# EAGLE design roverPCB_simpleRedone (EAGLE 9.3.2)
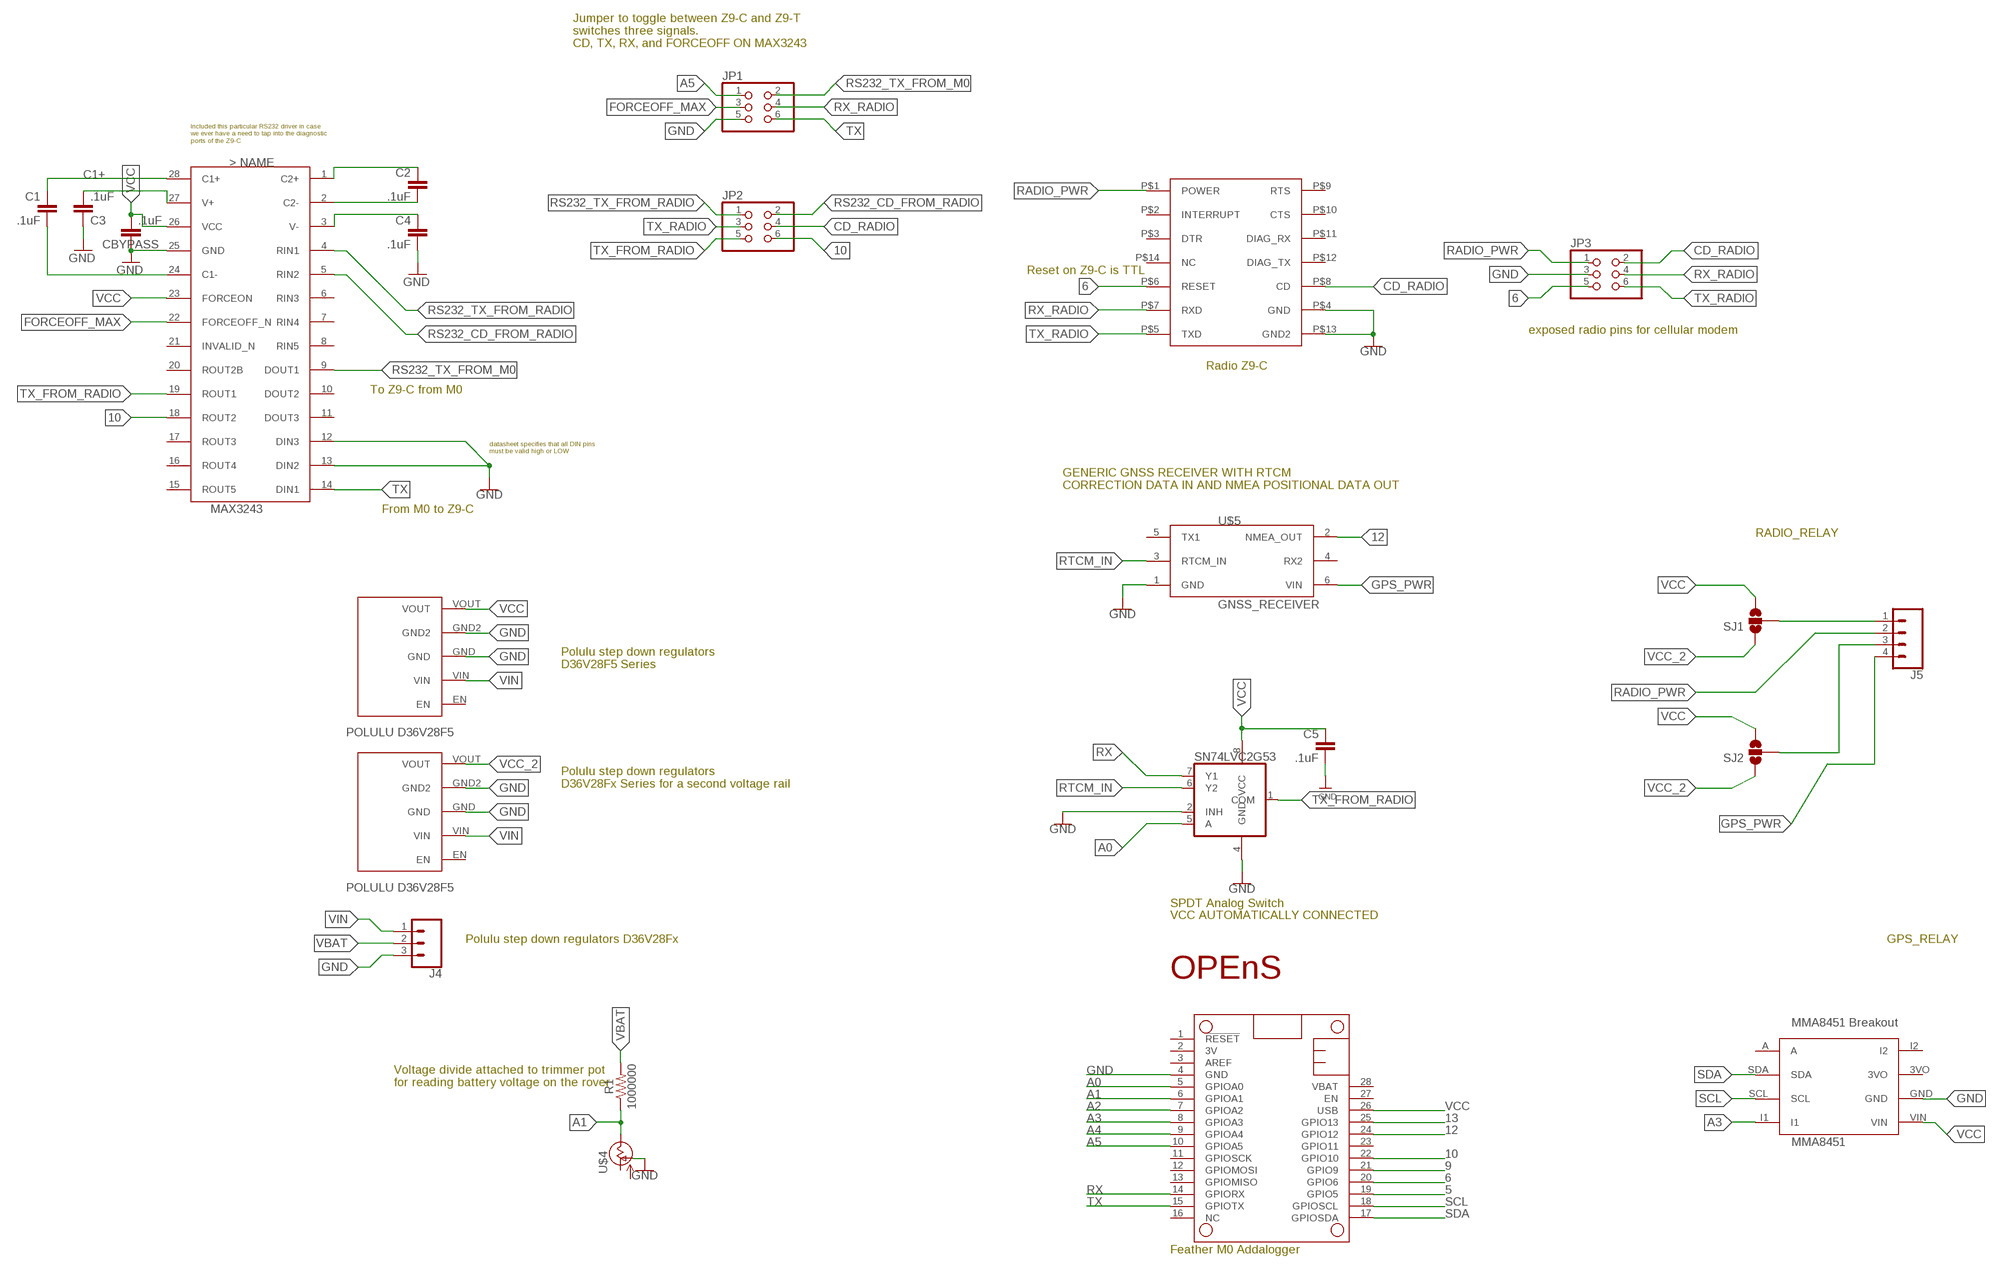
[diagram p0: schematic, sheet 1]

## Parts
C1  .1uF  CC1206  [C1206]
C2  .1uF  CC1206  [C1206]
C3  .1uF  CC1206  [C1206]
C4  .1uF  CC1206  [C1206]
C5  .1uF  CC1206  [C1206]
CBYPASS  .1uF  CC1206  [C1206]
J4  CONN_03SCREW  [SCREWTERMINAL-3.5MM-3]
J5  CONN_04SCREW  [SCREWTERMINAL-3.5MM-4]
JP1  PINHD-2X3  [2X03]
JP2  PINHD-2X3  [2X03]
JP3  PINHD-2X3  [2X03]
MS1  FEATHERWING  [FEATHERWING]
R1  1000000  1.6KOHM-0603-1/10W-1%  [0603]
SJ1  SOLDERJUMPER_2WAY-OLDT  [SJ_2]
SJ2  SOLDERJUMPER_2WAY-OLDT  [SJ_2]
SN74LVC2G53  741G53DCT  [DCT_R-PDSO-G8]
U$1  MAX3243  [SSOP-28]
U$2  OPENS-LOGO  [OPENS-LOGO]
U$3  Z9-T/Z9-CCOPY  [Z9-T/Z9-C-COPY]
U$4  CT6EP205  [CT6]
U$5  GNSS_RECEIVER  [MA03-2]
U$7  POLULU_D36V28FX  [POLULU_D36V28FX]
U$8  POLULU_D36V28FX  [POLULU_D36V28FX]
U$9  MMA8451  [MMA8451]

## Nets
5: MS1.19(GPIO5)
6: JP3.5 MS1.20(GPIO6) U$3.P$6(RESET)
9: MS1.21(GPIO9)
10: JP2.6 MS1.22(GPIO10) U$1.18(ROUT2)
12: MS1.24(GPIO12) U$5.2(NMEA_OUT)
13: MS1.25(GPIO13)
A0: MS1.5(GPIOA0) SN74LVC2G53.5(A)
A1: MS1.6(GPIOA1) R1.1 U$4.S(VSS)
A2: MS1.7(GPIOA2)
A3: MS1.8(GPIOA3) U$9.I1
A4: MS1.9(GPIOA4)
A5: JP1.1 MS1.10(GPIOA5)
C1+: C1.1 U$1.28(C1+)
CD_RADIO: JP2.4 JP3.2 U$3.P$8(CD)
FORCEOFF_MAX: JP1.3 U$1.22(FORCEOFF_N)
GND: C3.1 C4.2 C5.2 CBYPASS.1 J4.3 JP1.5 JP3.3 MS1.4(GND) SN74LVC2G53.2(INH) SN74LVC2G53.4(GND) U$1.12(DIN3) U$1.13(DIN2) U$1.25(GND) U$3.P$4(GND) U$3.P$13(GND2) U$4.A(OUT) U$5.1(GND) U$7.GND U$7.GND2 U$8.GND U$8.GND2 U$9.GND
GPS_PWR: J5.4 U$5.6(VIN)
N$4: C2.1 U$1.1(C2+)
N$5: C2.2 U$1.2(C2-)
N$9: J5.1 SJ1.2
N$10: C4.1 U$1.3(V-)
N$11: C1.2 U$1.24(C1-)
N$12: J5.3 SJ2.2
N$13: C3.2 U$1.27(V+)
RADIO_PWR [Power]: J5.2 JP3.1 U$3.P$1(POWER)
RS232_CD_FROM_RADIO: JP2.2 U$1.5(RIN2)
RS232_TX_FROM_M0: JP1.2 U$1.9(DOUT1)
RS232_TX_FROM_RADIO: JP2.1 U$1.4(RIN1)
RTCM_IN: SN74LVC2G53.6(Y2) U$5.3(RTCM_IN)
RX: MS1.14(GPIORX) SN74LVC2G53.7(Y1)
RX_RADIO: JP1.4 JP3.4 U$3.P$7(RXD)
SCL: MS1.18(GPIOSCL) U$9.SCL
SDA: MS1.17(GPIOSDA) U$9.SDA
TX: JP1.6 MS1.15(GPIOTX) U$1.14(DIN1)
TX_FROM_RADIO: JP2.5 SN74LVC2G53.1(COM) U$1.19(ROUT1)
TX_RADIO: JP2.3 JP3.6 U$3.P$5(TXD)
VBAT: J4.2 R1.2
VCC: C5.1 CBYPASS.2 MS1.26(USB) SJ1.3 SJ2.3 SN74LVC2G53.8(VCC) U$1.23(FORCEON) U$1.26(VCC) U$7.VOUT U$9.VIN
VCC_2: SJ1.1 SJ2.1 U$8.VOUT
VIN: J4.1 U$7.VIN U$8.VIN
Unconnected: MS1.1(!RESET) MS1.2(3V) MS1.3(AREF) MS1.11(GPIOSCK) MS1.12(GPIOMOSI) MS1.13(GPIOMISO) MS1.16(NC) MS1.23(GPIO11) MS1.27(EN) MS1.28(VBAT) U$1.6(RIN3) U$1.7(RIN4) U$1.8(RIN5) U$1.10(DOUT2) U$1.11(DOUT3) U$1.15(ROUT5) U$1.16(ROUT4) U$1.17(ROUT3) U$1.20(ROUT2B) U$1.21(INVALID_N) U$3.P$2(INTERRUPT) U$3.P$3(DTR) U$3.P$9(RTS) U$3.P$10(CTS) U$3.P$11(DIAG_RX) U$3.P$12(DIAG_TX) U$3.P$14(NC) U$4.E(VDD) U$5.4(RX2) U$5.5(TX1) U$7.EN U$8.EN U$9.3VO U$9.A U$9.I2

## Notes on the sheet
- Jumper to toggle between Z9-C and Z9-T
  switches three signals. 
  CD, TX, RX, and FORCEOFF ON MAX3243
- Included this particular RS232 driver in case
  we ever have a need to tap into the diagnostic
  ports of the Z9-C
- Reset on Z9-C is TTL
- exposed radio pins for cellular modem
- Radio Z9-C
- To Z9-C from M0
- datasheet specifies that all DIN pins 
  must be valid high or LOW
- GENERIC GNSS RECEIVER WITH RTCM
  CORRECTION DATA IN AND NMEA POSITIONAL DATA OUT
- From M0 to Z9-C
- RADIO_RELAY
- Polulu step down regulators 
  D36V28F5 Series
- Polulu step down regulators 
  D36V28Fx Series for a second voltage rail
- SPDT Analog Switch
- VCC AUTOMATICALLY CONNECTED
- Polulu step down regulators D36V28Fx | GPS_RELAY
- Voltage divide attached to trimmer pot 
  for reading battery voltage on the rover
- Feather M0 Addalogger

## Library data of the parts
C1-C5 CBYPASS = eagle-ltspice:C: CAPACITOR, European symbol; SPICEMODEL: NONE; SPICEPREFIX: C
J4 = SparkFun-Connectors:CONN_03: Multi connection point. Often used as Generic Header-pin footprint for 0.1 inch spaced/style header connections On any of the 0.1 inch spaced packages, you can populate with these: Break Away Headers - Straight <https://www.sparkfun.com/products/116> (PRT-00116) Break Away Male Headers - Right Angle <https://www.sparkfun.com/products/553> (PRT-00553) Female Headers <https://www.sparkfun.com/products/115> (PRT-00115) Break Away Headers - Machine Pin <https://www.sparkfun.com/products/117> (PRT-00117) Break Away Female Headers - Swiss Machine Pin <https://www.sparkfun.com/products/743> (PRT-00743) Stackable Header - 3 Pin (Female, 0.1") <https://www.sparkfun.com/products/13875> (PRT-13875) For SCREWTERMINALS and SPRING TERMINALS visit here: Screw Terimnals on SparkFun.com <https://www.sparkfun.com/search/results?term=Screw+Terminals> (5mm/3.5mm/2.54mm spacing) This device is also useful as a general connection point to wire up your design to another part of your project. Our various solder wires solder well into these plated through hole pads. Hook-Up Wire - Assortment (Stranded, 22 AWG) <https://www.sparkfun.com/products/11375> (PRT-11375) Hook-Up Wire - Assortment (Solid Core, 22 AWG) <https://www.sparkfun.com/products/11367> (PRT-11367) View the entire wire category on our website here <https://www.sparkfun.com/categories/141> Special notes: Molex polarized connector foot print use with SKU : PRT-08232 with associated crimp pins and housings.; PROD_ID: CONN-08288; SF_ID: PRT-08235
J5 = SparkFun-Connectors:CONN_04: Multi connection point. Often used as Generic Header-pin footprint for 0.1 inch spaced/style header connections On any of the 0.1 inch spaced packages, you can populate with these: Break Away Headers - Straight <https://www.sparkfun.com/products/116> (PRT-00116) Break Away Male Headers - Right Angle <https://www.sparkfun.com/products/553> (PRT-00553) Female Headers <https://www.sparkfun.com/products/115> (PRT-00115) Break Away Headers - Machine Pin <https://www.sparkfun.com/products/117> (PRT-00117) Break Away Female Headers - Swiss Machine Pin <https://www.sparkfun.com/products/743> (PRT-00743) For SCREWTERMINALS and SPRING TERMINALS visit here: Screw Terimnals on SparkFun.com <https://www.sparkfun.com/search/results?term=Screw+Terminals> (5mm/3.5mm/2.54mm spacing) This device is also useful as a general connection point to wire up your design to another part of your project. Our various solder wires solder well into these plated through hole pads. Hook-Up Wire - Assortment (Stranded, 22 AWG) <https://www.sparkfun.com/products/11375> (PRT-11375) Hook-Up Wire - Assortment (Solid Core, 22 AWG) <https://www.sparkfun.com/products/11367> (PRT-11367) View the entire wire category on our website here <https://www.sparkfun.com/categories/141> Special notes: Molex polarized connector foot print use with SKU : PRT-08231 with associated crimp pins and housings. 1MM SMD Version SKU: PRT-10208; PROD_ID: 2xCONN-08399; SF_ID: 2xPRT-08084
JP1-JP3 = pinhead:PINHD-2X3: PIN HEADER
MS1 = adafruit:FEATHERWING
R1 = SparkFun-Resistors:1.6KOHM: 1.6kΩ resistor A resistor is a passive two-terminal electrical component that implements electrical resistance as a circuit element. Resistors act to reduce current flow, and, at the same time, act to lower voltage levels within circuits. - Wikipedia; PROD_ID: RES-08361; VALUE: 1.6k
SJ1 SJ2 = SparkFun-Retired:SOLDERJUMPER_2WAY-OLD: Solder Jumper 2 way solder jumper
SN74LVC2G53 = 74xx-little-de:74*1G53: SINGLE-POLE DOUBLE-THROW (SPDT) ANALOG SWITCH 2:1 ANALOG MULTIPLEXER/DEMULTIPLEXER Source: http://focus.ti.com/lit/ds/symlink/sn74lvc2g53.pdf
U$1 = ftdi4:MAX3243: MAX3243 RS232 interface 5 receive lines 3 line drives 5V or 3.3V operating voltage
U$2 = opens-logo:OPENS-LOGO: OPENS Lab Logo
U$3 = SlideSentinel:Z9-T/Z9-C
U$4 = tango:CT6EP205
U$5 = SlideSentinel:GNSS_RECEIVER
U$7 U$8 = SlideSentinel:POLULU_D36V28FX
U$9 = SlideSentinel:MMA8451

## Net classes
0 default: width 0.305 mm, drill 0.508 mm, clearance 0.254 mm
1 Power: width 0.635 mm, drill 1.27 mm, clearance 0.508 mm

## Board
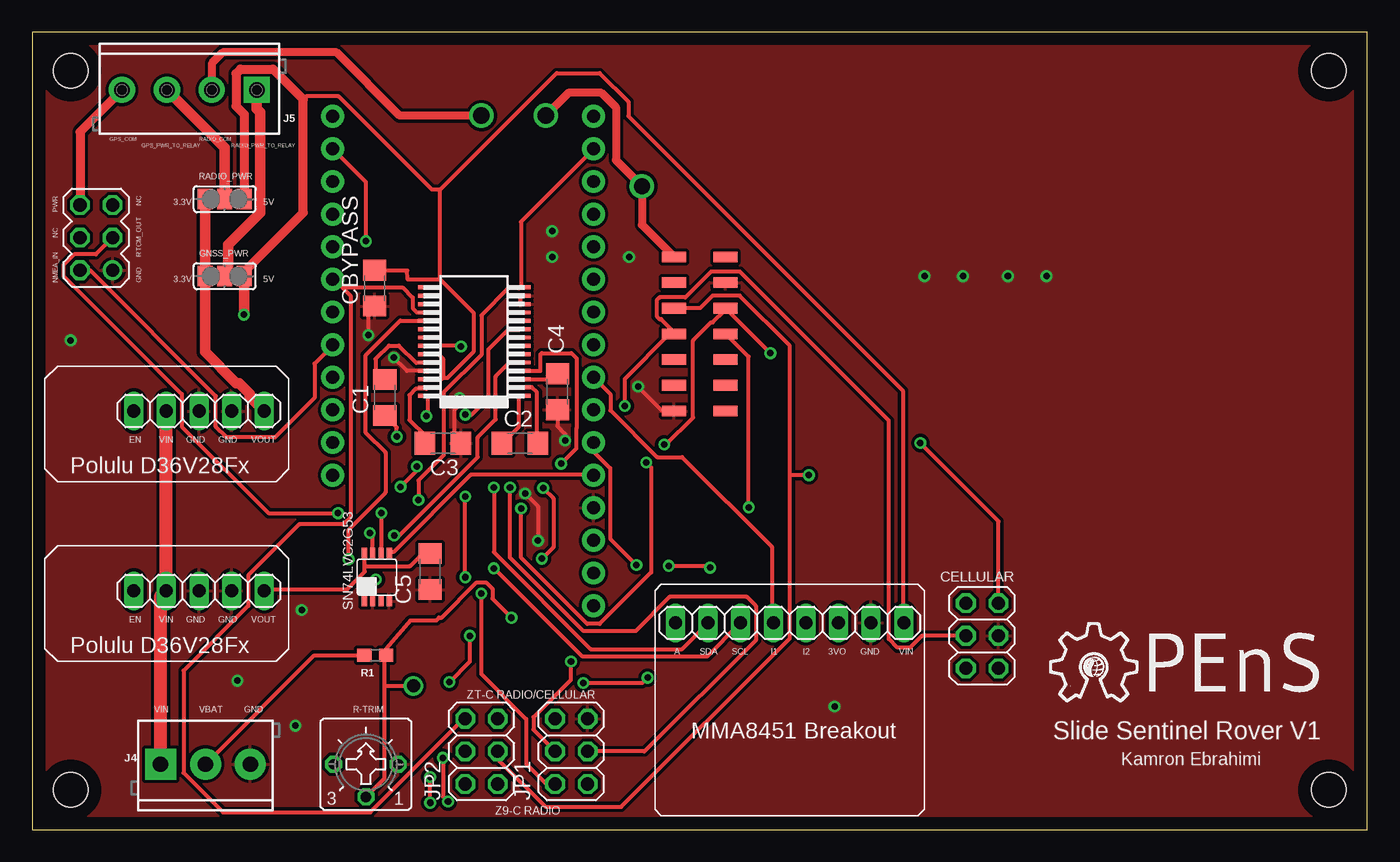
[diagram p1: board, top side]
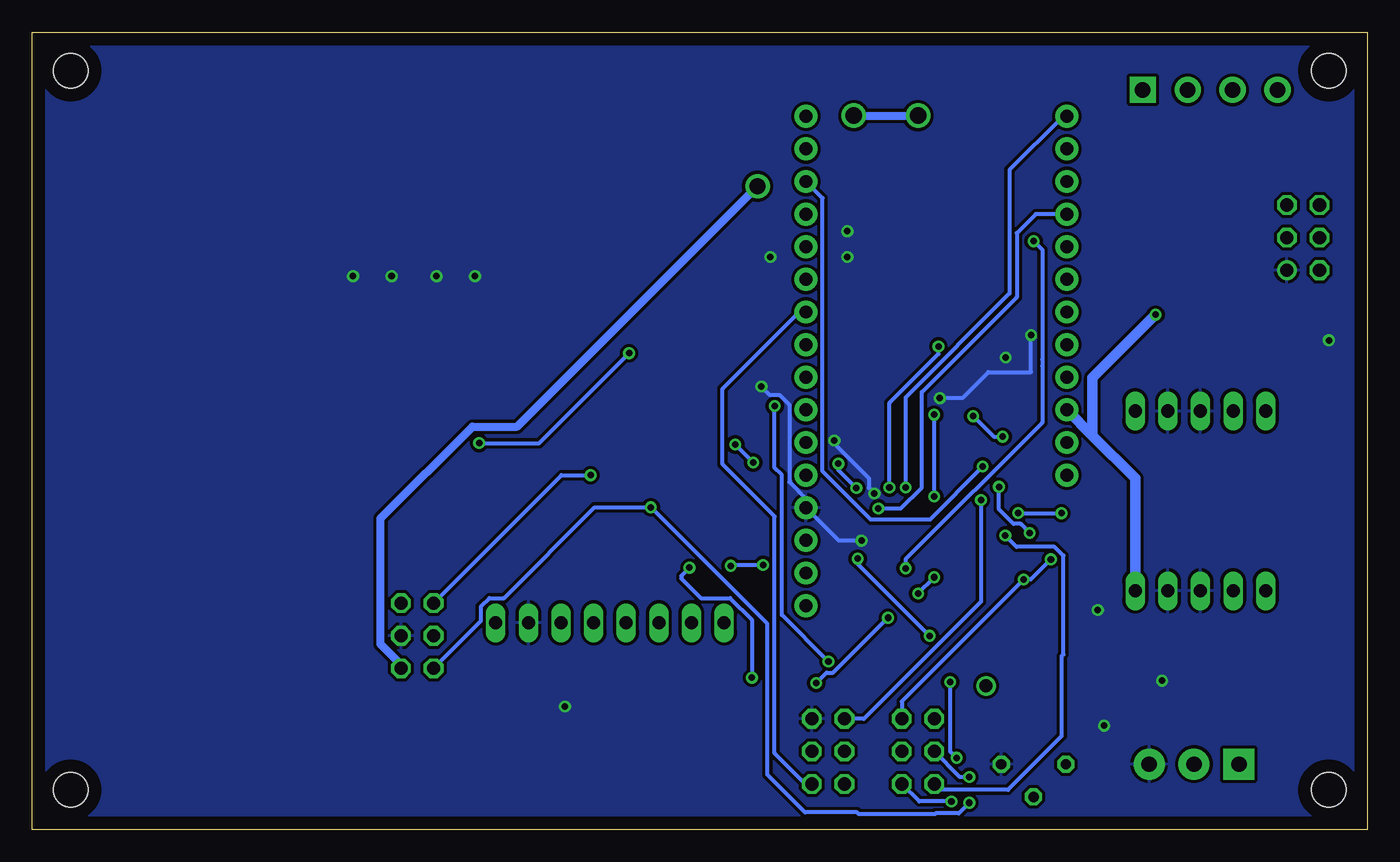
[diagram p2: board, bottom side, seen from below]

Size 104 x 62.1 mm. Coordinates in mm from the lower left corner, seen from the top.
Outline: 0,0 104,0 104,62.1 0,62.1 0,0
Copper layers (1*16): Top 0.035mm / dielectric 1.5mm / Bottom 0.035mm
Design rules "default": minimum track width 6mil, minimum drill 0.35mm, track to track 6mil, track to pad 6mil, pad to pad 6mil, via to via 6mil, smd to smd 6mil, copper to edge 40mil, drill to drill 6mil, minimum pad ring 10mil, minimum via ring 8mil, stop-mask expansion 4mil, vias tented up to drill 0mil, thermal gap 10mil
Holes 2.7 mm at 3,59.1 3,3.1 101,3.1 101,59.1

### Footprints (pad centres in the part's own frame; a part is rotated, then mirrored left to right if it is on the bottom)
C1206 = smd 1.6 x 1.8: 1 -1.4,0; 2 1.4,0
SCREWTERMINAL-3.5MM-3 = drill 1.2 pad 2.413 square: 1 0,0 | drill 1.2 pad 2.413: 2 3.5,0; 3 7,0
SCREWTERMINAL-3.5MM-4 = drill 1.2 pad 2.032 square: 1 0,0 | drill 1.2 pad 2.032: 2 3.5,0; 3 7,0; 4 10.5,0
2X03 = drill 1.016 octagon: 1 -2.54,-1.27; 2 -2.54,1.27; 3 0,-1.27; 4 0,1.27; 5 2.54,-1.27; 6 2.54,1.27
FEATHERWING = drill 1 pad 1.778: 1 6.35,1.27; 2 8.89,1.27; 3 11.43,1.27; 4 13.97,1.27; 5 16.51,1.27; 6 19.05,1.27; 7 21.59,1.27; 8 24.13,1.27; 9 26.67,1.27; 10 29.21,1.27; 11 31.75,1.27; 12 34.29,1.27; 13 36.83,1.27; 14 39.37,1.27; 15 41.91,1.27; 16 44.45,1.27; 17 44.45,21.59; 18 41.91,21.59; 19 39.37,21.59; 20 36.83,21.59; 21 34.29,21.59; 22 31.75,21.59; 23 29.21,21.59; 24 26.67,21.59; 25 24.13,21.59; 26 21.59,21.59; 27 19.05,21.59; 28 16.51,21.59
0603 = smd 1.1 x 1: 1 -0.85,0; 2 0.85,0
SJ_2 = smd 1.168 x 1.6: 1 -1.524,0; 2 0,0; 3 1.524,0
DCT_R-PDSO-G8 = smd 0.4 x 0.8: 1 -0.975,-1.875; 2 -0.325,-1.875; 3 0.325,-1.875; 4 0.975,-1.875; 5 0.975,1.875; 6 0.325,1.875; 7 -0.325,1.875; 8 -0.975,1.875
SSOP-28 = smd 0.3 x 1.5: 1 -4.225,-3.625; 2 -3.575,-3.625; 3 -2.925,-3.625; 4 -2.275,-3.625; 5 -1.625,-3.625; 6 -0.975,-3.625; 7 -0.325,-3.625; 8 0.325,-3.625; 9 0.975,-3.625; 10 1.625,-3.625; 11 2.275,-3.625; 12 2.925,-3.625; 13 3.575,-3.625; 14 4.225,-3.625; 15 4.225,3.625; 16 3.575,3.625; 17 2.925,3.625; 18 2.275,3.625; 19 1.625,3.625; 20 0.975,3.625; 21 0.325,3.625; 22 -0.325,3.625; 23 -0.975,3.625; 24 -1.625,3.625; 25 -2.275,3.625; 26 -2.925,3.625; 27 -3.575,3.625; 28 -4.225,3.625
Z9-T/Z9-C-COPY = smd 0.83 x 1.87: P$1 6,2; P$2 6,-2; P$3 4,2; P$4 4,-2; P$5 2,2; P$6 2,-2; P$7 0,2; P$8 0,-2; P$9 -2,2; P$10 -2,-2; P$11 -4,2; P$12 -4,-2; P$13 -6,2; P$14 -6,-2
CT6 = drill 0.813 octagon: A 2.515,0; E -2.515,0; S 0,-2.54
MA03-2 = drill 1.016: 1 -2.54,-1.27 | drill 1.016 octagon: 2 -2.54,1.27; 3 0,-1.27; 4 0,1.27; 5 2.54,-1.27; 6 2.54,1.27
POLULU_D36V28FX = drill 1.016 long: EN 0.08,-3.5; GND -7.54,-3.5; GND2 -5,-3.5; VIN -2.46,-3.5; VOUT -10.08,-3.5
MMA8451 = drill 1.016 long: 3VO 3.81,0; A -8.89,0; GND 6.35,0; I1 -1.27,0; I2 1.27,0; SCL -3.81,0; SDA -6.35,0; VIN 8.89,0

### Placement (x,y rotation side)
C1  27.48,33.64 90 top
C2  38,30.1 0 top
C3  32,30.1 180 top
C4  40.91,34.1 270 top
C5  31,20.1 270 top
CBYPASS  26.67,42.16 90 top
J4  10,5.1 0 top
J5  17.5,57.6 180 top
JP1  42,6.1 90 top
JP2  35,6.1 90 top
JP3  74,15.1 90 top
MS1  45,11.1 90 top
R1  26.73,13.58 180 top
SJ1  15,43.1 0 top
SJ2  15,49.1 0 top
SN74LVC2G53  26.85,19.67 0 top
U$1  34.43,38 90 top
U$2  79,6.21 0 top
U$3  52,38.6 90 top
U$4  26,5.1 0 top
U$5  5,46.1 90 top
U$7  8,15.1 180 top
U$8  8,29.1 180 top
U$9  59,16.1 0 top

### Tracks (layer width: path | path; a pad name or v marks a point on that pad's centre or on a via)
6  (via drill 0.51)
  Top 0.305: v49.24,29.99 49.38,29.99 51.47,32.09 51.47,38.1 52.87,39.49 53.01,39.49 53.99,40.47 U$3.P$6 v57.5,37.1 | v47.84,28.6 48.22,28.22 48.22,20.04 44.21,16.02 43.23,16.02 38.09,21.17 v38.09,25.02 | JP3.5 75.27,24.01 v69.18,30.1
  Bottom 0.305: v47.84,28.6 v49.24,29.99 | v38.09,25.02 36.34,25.02 34.71,26.64 34.71,34.07 27.31,41.47 27.31,46.44 25.82,47.93 MS1.20 | v69.18,30.1 64.5,30.1 v57.5,37.1
10
  Top 0.305: 24.15,42.23 23.53,42.85 MS1.22 | 24.15,42.23 24.79,41.59 24.79,24.34 24.21,23.77 20.8,23.77 16.83,19.8 16.83,17.42 11.8,12.39 11.8,4.43 14.87,1.36 26.33,1.36 33.61,8.64 JP2.6 | 24.15,42.23 28.85,42.23 29.65,41.43 29.65,40.61 29.99,40.27 30.8,40.27 U$1.18
12
  Top 0.305: U$5.2 3.84,43.54 4.54,43.54 14.32,33.77 14.32,31.39 15.15,30.55 18.92,30.55 22,33.63 22,36.28 23.4,37.68 MS1.24
A0
  Top 0.305: SN74LVC2G53.5 27.87,21.61 28.15,21.61 34.15,27.62 43.65,27.62 MS1.5
A1  (via drill 0.51, 1)
  Top 0.305: 27.45,11.2 27.45,4.01 26.05,2.61 U$4.S | 27.45,11.2 27.45,13.52 R1.1 27.58,14.08 29.49,16.3 31.49,16.3 31.69,16.51 31.88,16.51 34.63,19.26 35.35,19.26 35.85,18.76 35.85,17.99 v37.34,16.51 | 27.45,11.2 v29.7,11.2 | v47.07,20.61 45.02,22.66 45.02,28.15 43.73,29.44 MS1.6 | v49.58,20.55 52.65,20.55 v52.8,20.4 | v47.94,11.84 47.52,11.42 v42.93,11.42
  Bottom 0.305: v47.07,20.61 49.52,20.61 v49.58,20.55 | v52.8,20.4 53.43,19.77 53.43,19.55 51.91,18.03 49.63,18.03 47.94,16.34 v47.94,11.84 | v42.93,11.42 42.12,12.23 41.62,12.23 v37.34,16.51
A3
  Top 0.305: U$9.I1 57.62,16.16 57.62,22.03 50.64,29.02 48.68,29.02 45.05,32.65 45.05,33.91 43.79,35.16 MS1.8
A5
  Bottom 0.305: MS1.10 43.79,40.19 44.35,40.19 50.22,34.32 50.22,28.46 46.17,24.41 46.17,5.97 43.76,3.56 JP1.1
C1+  (via drill 0.51)
  Top 0.305: U$1.28 30.8,32.3 v30.7,32.2 | v28.4,30.6 28.4,31.32 C1.1
  Bottom 0.305: v30.7,32.2 29.1,30.6 v28.4,30.6
CD_RADIO  (via drill 0.51)
  Top 0.305: v55.81,25.11 55.81,36.84 54.13,38.52 U$3.P$8 | v31,2.1 v31,4.1
  Bottom 0.305: v31,2.1 31.83,1.27 33.63,1.27 33.68,1.22 39.6,1.22 39.74,1.36 43.79,1.36 46.73,4.29 46.73,16.02 v55.81,25.11 60.19,25.11 67.26,18.03 68.37,18.03 69.06,17.35 69.06,16.23 JP3.2 | v31,4.1 31.73,4.1 JP2.4
FORCEOFF_MAX  (via drill 0.51)
  Top 0.305: v33.4,37.61 33.34,37.68 30.94,37.68 U$1.22 | v37.23,26.64 37.23,21.19 42.95,15.47 47.01,15.47 49.66,18.12 55.67,18.12 56.36,17.42 56.36,14.77 47.7,6.1 JP1.3
  Bottom 0.305: v33.4,37.61 33.4,37.05 37.23,33.23 v37.23,26.64
GND  (via drill 0.51)
  Top 0.305: CBYPASS.1 26.19,40.28 v26.19,38.5 26.13,38.5 | 26.57,17.75 SN74LVC2G53.2 | U$3.P$13 49.1,32.6 v47.2,34.5 | v33.3,33.6 33.3,33.1 32.87,32.67 32.87,30.63 C3.1 | v38.4,26.18 39.4,25.18 v39.4,22.5 | v28.17,36.76 29.2,35.73 U$1.25 | C4.2 40.91,31.42 41.52,30.81 v41.52,30.31 | U$1.12 U$1.13 38.08,41.59
  Bottom 0.305: 15.67,18.6 U$7.GND | v47.2,34.5 46.56,33.86 45.8,33.86 45.02,33.08 45.02,27.07 43.73,25.78 MS1.4 41.16,22.5 v39.4,22.5 | v33.3,33.6 31.55,33.6 29.53,35.62 26.19,35.62 v26.19,38.5 | v38.4,26.18 38.84,26.62 38.84,27.36 41.52,30.04 v41.52,30.31
  other vias: 21,17.1 40.5,46.6 40.5,44.6 46.5,44.6 69.5,43.1 72.5,43.1 76,43.1 79,43.1 20.5,8.1 16,11.6 3,38.1 62.5,9.6
  pour Top: 0,62.1 104,62.1 104,0 0,0
  pour Bottom: 0,62.1 104,62.1 104,0 0,0
GPS_PWR
  Top 0.7: J5.4 3.73,54.33 U$5.6
N$4
  Top 0.305: U$1.1 37.92,33.77 37.92,31.39 36.67,30.13 C2.1
N$5
  Top 0.305: U$1.2 38.06,34.46 38.9,34.46 39.32,34.04 39.32,30.13 C2.2
N$9
  Top 0.8: SJ1.2 15.29,43.39 15.29,45.55 17.76,48.03 17.76,55.87 17.5,56.13 J5.1
N$10
  Top 0.305: U$1.3 40.91,35.07 C4.1
N$11
  Top 0.305: U$1.24 30.77,36.34 29.91,36.34 28.56,37.69 27.79,37.69 26.75,36.65 26.75,35.77 C1.2
N$12
  Top 0.8: SJ2.2 15,53.1 J5.3
N$13
  Top 0.305: C3.2 30.6,30.7 29.4,31.9 29.4,33.85 29.89,34.33 30.71,34.33 U$1.27
RADIO_PWR  (via drill 1.27)
  Top 0.635: J5.2 14.04,57.66 14.04,59.71 14.85,60.53 23.7,60.53 28.63,55.6 v35,55.6 | U$3.P$1 47.5,47.1 v47.5,50.1 45.47,52.13 45.47,56.26 44.35,57.38 41.77,57.38 v40,55.6
  Bottom 0.635: JP3.1 75.27,12.86 76.86,14.44 76.86,24.23 69.71,31.38 66.22,31.38 v47.5,50.1 | v40,55.6 v35,55.6
RS232_CD_FROM_RADIO  (via drill 0.51)
  Top 0.305: U$1.5 37.92,36.42 37.23,36.42 36.11,35.3 36.11,31.95 34.71,30.55 34.71,29.02 28.59,22.9 v28.2,22.9
  Bottom 0.305: v28.2,22.9 27.33,22.03 24.37,22.03 23.67,21.33 23.67,13.65 23.8,13.52 23.8,7.3 28,3.1 33.27,3.1 JP2.2
RS232_TX_FROM_M0  (via drill 0.51)
  Top 0.305: v33.73,32.31 34.23,32.31 35.55,33.63 35.55,37.4 37.09,38.93 37.92,38.93 U$1.9 | v33.73,19.66 v33.73,25.94 | v34.99,18.4 34.99,12.11 38.48,8.62 38.48,5.13 40.05,3.56 JP1.2
  Bottom 0.305: v33.73,25.94 v33.73,32.31 | v34.99,18.4 v33.73,19.66
RS232_TX_FROM_RADIO  (via drill 0.51)
  Top 0.305: U$1.4 39.59,35.73 39.59,37.01 39.68,37.1 42.01,37.1 42.42,36.69 42.42,31.26 42.38,31.22 42.38,29.68 v41.2,28.5 | v39.8,26.6 40.6,25.8 40.6,22 v39.7,21.1 | v32.5,11.5 34.1,13.1 v34.1,15.1 | v32.4,2.2 32,2.6 v32,5.6
  Bottom 0.305: v41.2,28.5 41.2,28 v39.8,26.6 | v34.1,15.1 39.7,20.7 v39.7,21.1 | v32.5,11.5 32.5,6.1 v32,5.6 | JP2.1 34.91,2.2 v32.4,2.2
RTCM_IN  (via drill 0.51)
  Top 0.305: v27.21,24.67 27.17,24.62 27.17,21.61 SN74LVC2G53.6 | v23.83,24.64 18.41,24.64 11.66,31.39 11.66,33.91 2.44,43.13 2.44,43.96 3.28,44.8 4.95,44.8 6.21,46.06 U$5.3
  Bottom 0.305: v27.21,24.67 27.19,24.64 v23.83,24.64
RX  (via drill 0.51)
  Top 0.305: SN74LVC2G53.7 26.52,22.88 v26.3,23.1 | v28.7,26.7 29.96,27.96 v29.96,28.28
  Bottom 0.305: v26.3,23.1 27,23.8 27.57,23.8 28.7,24.94 v28.7,26.7 | v29.96,28.28 34.09,24.15 38.68,24.15 42.44,27.91 42.44,49.18 MS1.14
RX_RADIO  (via drill 0.51)
  Top 0.305: v41.98,13.09 41.98,11.69 39.04,8.76 39.04,7.79 JP1.4 | v46.16,32.99 46.16,35.1 49.66,38.6 U$3.P$7 50,38.74 48.99,39.75 48.88,39.75 48.64,39.99 48.64,41.21 48.88,41.45 50.88,41.45 52.88,43.45 55.12,43.45 66.72,31.85 66.72,14.85 67.41,14.17 68.37,14.17 69.3,15.1 JP3.4
  Bottom 0.305: v46.16,32.99 46.16,28.17 45.61,27.62 45.61,16.72 v41.98,13.09
SCL  (via drill 0.51)
  Top 0.305: v35.97,20.36 42.81,13.51 52.59,13.51 55.11,16.02 U$9.SCL | v25.99,45.82 25.99,50.45 23.53,52.91 MS1.18
  Bottom 0.305: v35.97,20.36 35.97,21.05 25.33,31.69 25.33,36.1 25.33,36.6 25.33,45.16 v25.99,45.82
SDA  (via drill 0.51)
  Top 0.305: v35.97,26.64 35.97,21.61 43.51,14.07 50.64,14.07 52.59,16.02 U$9.SDA
  Bottom 0.305: v35.97,26.64 35.97,33.65 27.87,41.75 27.87,51.37 23.81,55.42 23.53,55.42 MS1.17
TX  (via drill 0.51)
  Top 0.305: MS1.15 43.65,52.91 38.06,47.32 38.06,42.29 U$1.14 37.92,42.15 37.09,42.15 34.99,40.05 34.99,36.98 32.06,34.04 32.06,29.16 30.1,27.2 v30.1,25.66
  Bottom 0.305: v30.1,25.66 30.1,17.76 39.22,8.64 JP1.6
TX_FROM_RADIO  (via drill 0.51)
  Top 0.305: v26.77,19.49 25.91,18.63 25.91,17.84 SN74LVC2G53.1 | v24.65,21.05 24.65,23.37 27.53,26.24 27.53,29.37 25.99,30.91 25.99,36.96 28.67,39.63 U$1.19
  Bottom 0.305: v24.65,21.05 26.22,19.49 v26.77,19.49 36.27,9.99 JP2.5
TX_RADIO  (via drill 0.51)
  Top 0.305: 59.02,27.6 59.02,14.91 45.89,1.77 40,1.77 36.27,5.51 JP2.3 | 59.02,27.6 59.02,37.68 55.11,41.59 53.01,41.59 52.03,40.61 50.08,40.61 U$3.P$5 | v60.5,27.6 59.02,27.6
  Bottom 0.305: JP3.6 62.77,27.6 v60.5,27.6
VBAT
  Top 0.305: J4.2 21.98,13.58 R1.2
VCC  (via drill 0.51)
  Top 0.305: SN74LVC2G53.8 25.91,21.47 25.91,20.6 | U$7.VOUT 18.09,18.68 24.5,18.68 25.91,20.09 25.91,20.6 | 16.55,43.13 SJ1.3 | 16.41,49.13 SJ2.3 | 32,35.16 32.34,35.16 34.37,37.2 34.37,40.25 31.78,42.85 | 31.78,42.85 29.26,42.85 29.22,43.56 CBYPASS.2 | 31.78,49.83 40.86,58.91 44.21,58.91 46.45,56.68 46.45,55.56 67.82,34.18 67.82,16.16 U$9.VIN | 31.78,42.85 31.78,49.83 | 31.78,49.83 31.14,49.83 23.87,57.1 21.35,57.1 21.12,56.87 | U$1.23 30.83,37 31.65,37 32,36.66 32,35.16 | U$1.26 31.91,35.07 32,35.16 | 25.91,20.6 25.98,20.53 29.43,20.53 30.4,21.5 C5.1
  Top 0.7: 16.41,49.13 16.52,49.02 16.52,55.69 15.88,56.33 15.88,58.87 16.23,59.22 18.77,59.22 21.12,56.87 21.12,48.04 16.52,43.44 SJ1.3
  Top 0.8: v16.5,40.1 16.5,43.08 16.55,43.13
  Bottom 0.8: U$7.VOUT 18.08,27.36 21.41,30.69 | 21.41,30.69 MS1.26 | 21.41,30.69 21.41,35.19 v16.5,40.1
VCC_2
  Top 0.8: U$8.VOUT 16.96,33.72 16.96,33.95 16.13,34.78 15.9,34.78 13.48,37.2 SJ1.1 SJ2.1
VIN
  Top 1: J4.1 10,18.14 U$7.VIN U$8.VIN

### Text on the board
tNames: GPS_COM | RADIO_COM | GPS_PWR_TO_RELAY | RADIO_PWR_TO_RELAY | RADIO_PWR | PWR | NC | 3.3V | 5V | NC | RTCM_OUT | GNSS_PWR | NMEA_IN | GND | 3.3V | 5V | CELLULAR | ZT-C RADIO/CELLULAR | VIN | VBAT | GND | R-TRIM | Slide Sentinel Rover V1 | Kamron Ebrahimi | Z9-C RADIO
tValues: 6 | RX2 | GND | TX2 | V_OUT | 10 | PWR